# Altium schematic sheet USB_Serial.SchDoc
size A3; Organization: Altium Limited; Address1: L3, 12a Rodborough Rd; Address2: Frenchs Forest; Address3: NSW; Address4: Australia 2086; DocumentNumber: 8; SheetNumber: 8; SheetTotal: 8
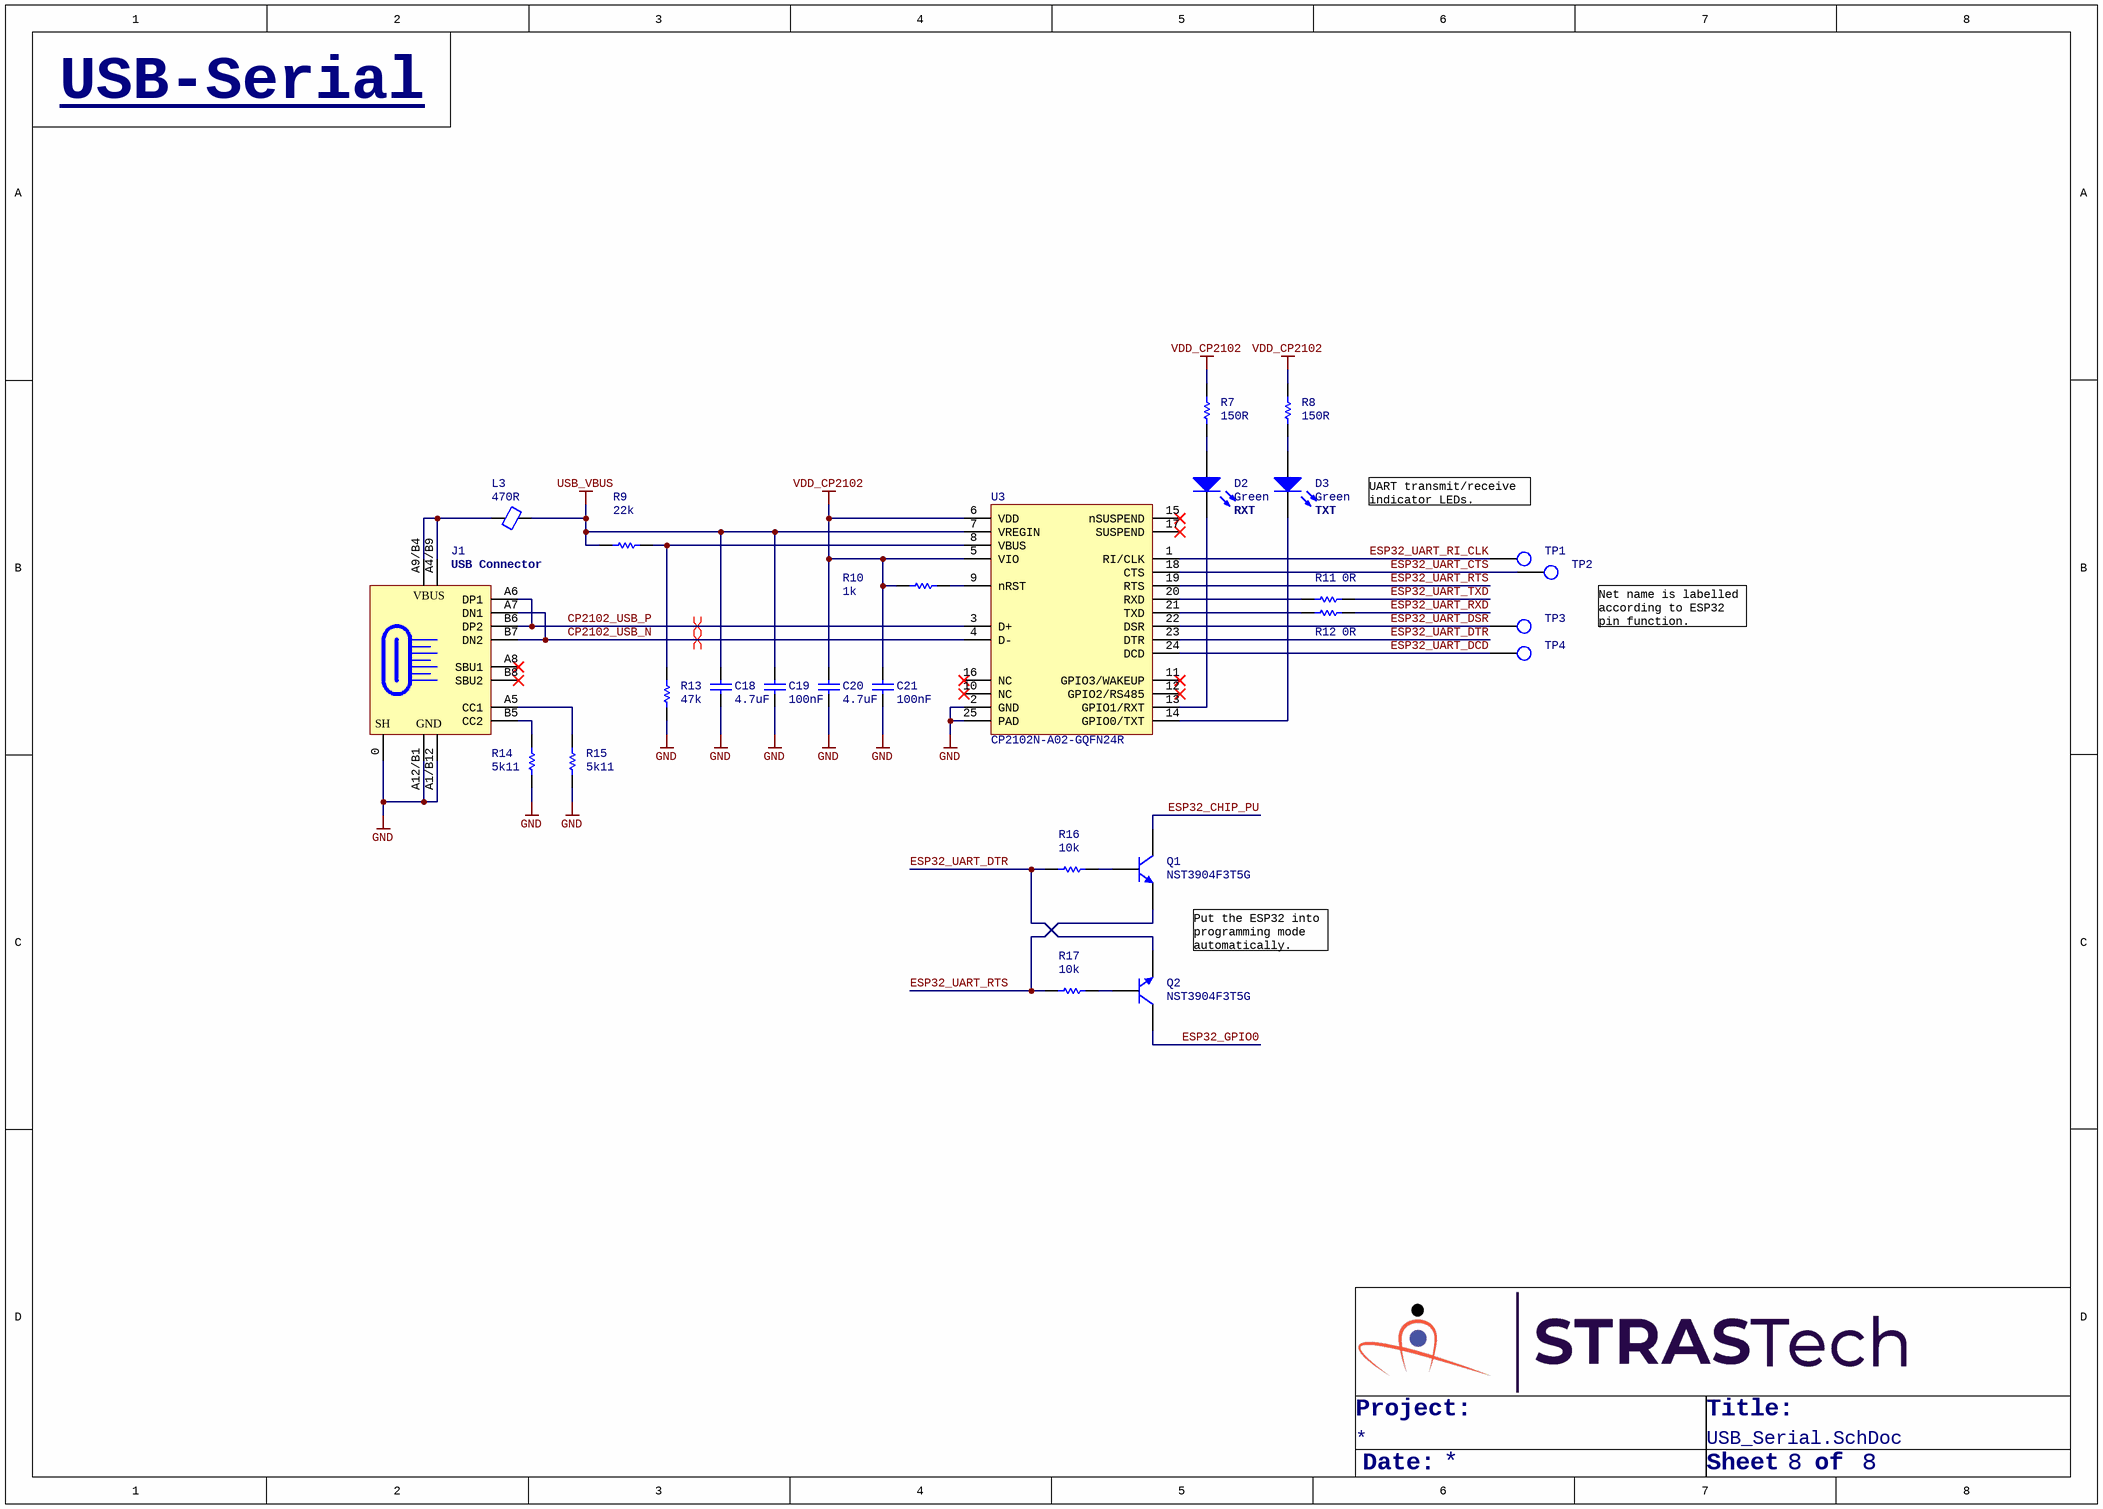
[diagram p0: USB_Serial.SchDoc]

## Parts
C18  4.7uF  [Cap,SMD,0402]
C19  100nF  [Cap,SMD,0402]
C20  4.7uF  [Cap,SMD,0402]
C21  100nF  [Cap,SMD,0402]
D2  Green  [LED,0603]
D3  Green  [LED,0603]
J1  USB  [CONN,USB_C,SMD]  (value not drawn)
L3  470R  [IND,0402]
Q1  NST3904F3T5G  [SOT1123]
Q2  NST3904F3T5G  [SOT1123]
R7  150R  [RES,0402]
R8  150R  [RES,0402]
R9  22k  [RES,0402]
R10  1k  [RES,0402]
R11  0R  [RES,0402]
R12  0R  [RES,0402]
R13  47k  [RES,0402]
R14  5k11  [RES,0402]
R15  5k11  [RES,0402]
R16  10k  [RES,0402]
R17  10k  [RES,0402]
TP1  TESTPOINT  [testpoint,smd,round,1mm]  (value not drawn)
TP2  TESTPOINT  [testpoint,smd,round,1mm]  (value not drawn)
TP3  TESTPOINT  [testpoint,smd,round,1mm]  (value not drawn)
TP4  TESTPOINT  [testpoint,smd,round,1mm]  (value not drawn)
U3  CP2102N-A02-GQFN24R  [IC,VQFN-24,THERMAL,4x4]

## Nets
GND: C18.1 C19.1 C20.1 C21.1 J1.0(SHIELD) J1.A1/B12(GND) J1.A12/B1(GND) R13.1 R14.1 R15.1 U3.2(GND) U3.25(PAD)
USB_VBUS: C18.2 C19.2 L3.2 R9.1 U3.7(VREGIN)
VDD_CP2102: C20.2 C21.2 R7.2 R8.2 R10.2 U3.5(VIO) U3.6(VDD)
CP2102_USB_N: J1.A7(DN1) J1.B7(DN2) U3.4(D-)
CP2102_USB_P: J1.A6(DP1) J1.B6(DP2) U3.3(D+)
ESP32_CHIP_PU: Q1.3(C)
ESP32_GPIO0: Q2.3(C)
ESP32_UART_CTS: TP2.1(TP) U3.18(CTS)
ESP32_UART_DCD: TP4.1(TP) U3.24(DCD)
ESP32_UART_DSR: TP3.1(TP) U3.22(DSR)
ESP32_UART_DTR: Q2.2(E) R16.2 U3.23(DTR)
ESP32_UART_RI_CLK: TP1.1(TP) U3.1(RI/CLK)
ESP32_UART_RTS: Q1.2(E) R17.2 U3.19(RTS)
ESP32_UART_RXD: R12.2
ESP32_UART_TXD: R11.2
NetD2_1: D2.1(A) R7.1
NetD2_2: D2.2(K) U3.13(GPIO1/RXT)
NetD3_1: D3.1(A) R8.1
NetD3_2: D3.2(K) U3.14(GPIO0/TXT)
NetJ1_A4/B9: J1.A4/B9(VBUS) J1.A9/B4(VBUS) L3.1
NetJ1_A5: J1.A5(CC1) R15.2
NetJ1_B5: J1.B5(CC2) R14.2
NetQ1_1: Q1.1(B) R16.1
NetQ2_1: Q2.1(B) R17.1
NetR9_2: R9.2 R13.2 U3.8(VBUS)
NetR10_1: R10.1 U3.9(nRST)
NetR11_1: R11.1 U3.20(RXD)
NetR12_1: R12.1 U3.21(TXD)

Not connected (* = marked no-connect by the designer): J1 A8(SBU1)* B8(SBU2)*; U3 10(NC)* 11(GPIO3/WAKEUP)* 12(GPIO2/RS485)* 15(nSUSPEND)* 16(NC)* 17(SUSPEND)*

## Layout directives
differential pair: CP2102_USB_N, CP2102_USB_P

## Notes on the sheet
- USB-Serial
- RXT
- (near D3) TXT
- UART transmit/receive indicator LEDs.
- (near J1) USB Connector
- Net name is labelled according to ESP32 pin function.
- Put the ESP32 into programming mode automatically.
- Project:
- Title:
- Date:
- Sheet
- of
- Title
- Size:
- A3
- Revision:
- Design By:
- (in symbol Conn,USB_C,SMD) SH

## Library data of the parts
C18 C20 = CAP,Cer,4.7uF,16VDC,X5R,0402: 4.7 µF ±20% 16V Ceramic Capacitor X5R 0402 (1005 Metric); Vendor Part Number: 478-10788-1-ND; Manufacturer: AVX Corporation; Manufacturer Part Number: 0402YD475MAT2A; Vendor: Digikey; HelpURL: https://datasheets.avx.com/cx5r.pdf; CreatedBy: Judd Foster
C19 C21 = CAP,Cer,100nF,25VDC,X7R,0402: 0.1µF ±10% 25V Ceramic Capacitor X7R 0402 (1005 Metric); Vendor Part Number: 490-14603-1-ND; Manufacturer: Murata Electronics; Manufacturer Part Number: GRM155R71E104KE14J; Vendor: Digikey; HelpURL: https://search.murata.co.jp/Ceramy/image/img/A01X/G101/ENG/GRM155R71E104KE14-01.pdf; CreatedBy: Judd Foster
D2 D3 = LED,Green,SMD,0603: Green 530nm LED Indication - Discrete 3V 0603 (1608 Metric); Manufacturer: Stanley Electric Co; Manufacturer Part Number: THG1111C-0005-TR; Vendor Part Number: 404-1286-1-ND; Vendor: Digikey; CreatedBy: Judd Foster; HelpURL: http://www.stanley-components.com/php/downloaddatafile.php?rp=0,THG1111C-0005_e.pdf
J1 = Conn,USB_C,SMD: USB-C (USB TYPE-C) USB 2.0 Receptacle Connector 24 (16+8 Dummy) Position Surface Mount, Right Angle; Manufacturer: GCT; Manufacturer Part Number: USB4110-GF-A; Vendor Part Number: 2073-USB4110-GF-A-1-ND; Vendor: Digikey; CreatedBy: Judd Foster; HelpURL: https://gct.co/files/drawings/usb4110.pdf
L3 = Ferrite,470R@100MHz,0402: 470 Ohms @ 100 MHz 1 Power Line Ferrite Bead 0402 (1005 Metric) 1A 200mOhm; Vendor Part Number: 490-10662-1-ND; Manufacturer: Murata Electronics; Manufacturer Part Number: BLM15PX471SN1D; Vendor: Digikey; HelpURL: https://www.murata.com/en-us/products/productdata/8796740059166/ENFA0018.pdf; CreatedBy: Judd Foster
Q1 Q2 = Trans,NPN,40V,200mA,SOT1123: Bipolar (BJT) Transistor NPN 40 V 200 mA 200MHz 290 mW Surface Mount SOT-1123; Manufacturer: ON Semiconductor; Vendor Part Number: NST3904F3T5GOSCT-ND; Vendor: Digikey; CreatedBy: Judd Foster; HelpURL: https://www.onsemi.com/pdf/datasheet/nst3904f3-d.pdf; Manufacturer Part Number: NST3904F3T5G
R7 R8 = RES,150R,1%,0.1W,0402: 150 Ohms ±1% 0.063W, 1/16W Chip Resistor 0402 (1005 Metric) Automotive AEC-Q200, Moisture Resistant Thick Film; Manufacturer: TE Connectivity Passive Product; Manufacturer Part Number: CRGCQ0402F150R; Vendor Part Number: A129617CT-ND; Vendor: Digikey; CreatedBy: Judd Foster; HelpURL: https://www.te.com/commerce/DocumentDelivery/DDEController?Action=srchrtrv&DocNm=1773204-3&DocType=DS&DocLang=English
R9 = RES,22k,1%,0.063W,0402: 22 kOhms ±1% 0.063W, 1/16W Chip Resistor 0402 (1005 Metric) Automotive AEC-Q200 Thick Film; Vendor Part Number: RMCF0402FT22K0CT-ND; Manufacturer: Stackpole Electronics Inc; Manufacturer Part Number: RMCF0402FT22K0; Vendor: DIgikey; HelpURL: https://www.seielect.com/catalog/sei-rmcf_rmcp.pdf; CreatedBy: Judd Foster
R10 = RES,1k,5%,0.063W,0402: 1 kOhms ±5% 0.063W, 1/16W Chip Resistor 0402 (1005 Metric) Automotive AEC-Q200 Thick Film; Vendor Part Number: RMCF0402JT1K00CT-ND; Manufacturer: Stackpole Electronics Inc; Manufacturer Part Number: RMCF0402JT1K00; Vendor: DIgikey; HelpURL: https://www.seielect.com/catalog/sei-rmcf_rmcp.pdf; CreatedBy: Judd Foster
R11 R12 = RES,0R0,0.1W,0402: 0 Ohms Jumper 0.1W, 1/10W Chip Resistor 0402 (1005 Metric) Automotive AEC-Q200 Thick Film; Manufacturer: Panasonic Electronic Components; Manufacturer Part Number: ERJ-2GE0R00X; Vendor Part Number: P0.0JCT-ND; Vendor: Digikey; CreatedBy: Judd Foster; HelpURL: https://industrial.panasonic.com/cdbs/www-data/pdf/RDA0000/AOA0000C301.pdf
R13 = RES,47k,1%,0.1W,0402: 47 kOhms ±1% 0.1W, 1/10W Chip Resistor 0402 (1005 Metric) Automotive AEC-Q200 Thick Film; Manufacturer: Panasonic Electronic Components; Manufacturer Part Number: ERJ-2RKF4702X; Vendor Part Number: P47.0KLCT-ND; Vendor: Digikey; CreatedBy: Judd Foster; HelpURL: https://industrial.panasonic.com/cdbs/www-data/pdf/RDA0000/AOA0000C304.pdf
R14 R15 = RES,5k11,1%,0.063W,0402: 5.11 kOhms ±1% 0.063W, 1/16W Chip Resistor 0402 (1005 Metric) Automotive AEC-Q200, Moisture Resistant Thick Film; Manufacturer: Yageo; Manufacturer Part Number: AC0402FR-075K11L; Vendor Part Number: 13-AC0402FR-075K11LCT-ND; Vendor: Digikey; CreatedBy: Judd Foster; HelpURL: https://www.yageo.com/upload/media/product/productsearch/datasheet/rchip/PYu-AC_51_RoHS_L_7.pdf
R16 R17 = RES,10k,5%,0.063W,0402: 10 kOhms ±5% 0.063W, 1/16W Chip Resistor 0402 (1005 Metric) Automotive AEC-Q200 Thick Film; Vendor Part Number: RMCF0402JT10K0CT-ND; Manufacturer: Stackpole Electronics Inc; Manufacturer Part Number: RMCF0402JT10K0; Vendor: DIgikey; HelpURL: https://www.seielect.com/catalog/sei-rmcf_rmcp.pdf; CreatedBy: Judd Foster
TP1-TP4 = TESTPOINT: PCB Testpoint; CreatedBy: Judd Foster; HelpURL: N/A; Manufacturer: N/A; Manufacturer Part Number: N/A; Vendor: N/A; Vendor Part Number: N/A
U3 = CP2102N-A02-GQFN24R: USB Bridge, USB to UART USB 2.0 UART Interface 24-QFN (4x4); Manufacturer: Silicon Labs; Vendor Part Number: 336-5888-1-ND; Vendor: Digikey; CreatedBy: Judd Foster; HelpURL: https://www.silabs.com/documents/public/data-sheets/cp2102n-datasheet.pdf; Manufacturer Part Number: CP2102N-A02-GQFN24R